# Altium project MPU6050_Board.PrjPcb
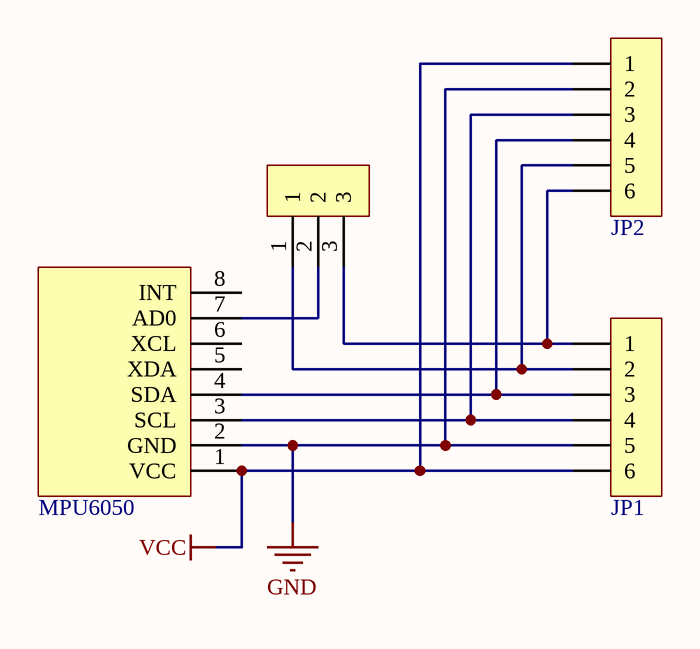
[diagram p0: MPU6050_Board.SchDoc]
1 sheet, 4 parts. Net scope: global (net labels, ports and power ports of the same name join across sheets).
Board file: MPU6050_Board.PcbDoc

## Sheet MPU6050_Board.SchDoc
size A4; SheetNumber: 1; SheetTotal: 1

### Parts
*  MPU6050  [PCBComponent_1]
JP1  HDR-1X6  [MX 1.25-WS-6P]  (value not drawn)
JP2  HDR-1X6  [MX 1.25-WS-6P]  (value not drawn)
  跳线 3-2  [跳线 3-2]  (value not drawn)

### Nets
GND: *.2(GND) JP1.5 JP2.2
VCC: *.1(VCC) JP1.6 JP2.1
Net*_3: *.3(SCL) JP1.4 JP2.3
Net*_4: *.4(SDA) JP1.3 JP2.4
Net*_7: *.7(AD0) .2
NetJP1_1: JP1.1 JP2.6 .3
NetJP1_2: JP1.2 JP2.5 .1

Not connected (* = marked no-connect by the designer): * 5(XDA) 6(XCL) 8(INT)

### Library data of the parts
JP1 JP2 = Header 6: 6P接插件; 版权归属: 源创客; BOM名称: 6P接插件; 学习资源: www.ooocke.com